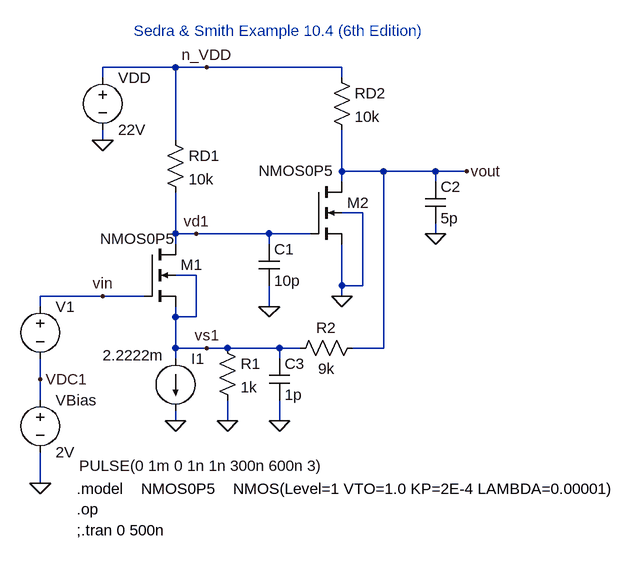
[diagram p0: schematic Sedra_Smith_Ex_10.4_2.asc]
Sedra_Smith_Ex_10.4_2.asc, the LTspice schematic file:
Version 4
SHEET 1 1708 680
WIRE 224 -80 112 -80
WIRE 272 -80 224 -80
WIRE 480 -80 272 -80
WIRE 112 -64 112 -80
WIRE 480 -64 480 -80
WIRE 112 32 112 16
WIRE 224 32 224 -80
WIRE 480 80 480 16
WIRE 544 80 480 80
WIRE 624 80 544 80
WIRE 672 80 624 80
WIRE 480 96 480 80
WIRE 624 96 624 80
WIRE 512 144 480 144
WIRE 224 176 224 112
WIRE 256 176 224 176
WIRE 368 176 256 176
WIRE 432 176 368 176
WIRE 624 176 624 160
WIRE 224 192 224 176
WIRE 368 192 368 176
WIRE 256 240 224 240
WIRE 480 256 480 192
WIRE 512 256 512 144
WIRE 512 256 480 256
WIRE 112 272 16 272
WIRE 176 272 112 272
WIRE 480 272 480 256
WIRE 16 288 16 272
WIRE 368 288 368 256
WIRE 224 304 224 288
WIRE 256 304 256 240
WIRE 256 304 224 304
WIRE 224 352 224 304
WIRE 272 352 224 352
WIRE 304 352 272 352
WIRE 384 352 304 352
WIRE 416 352 384 352
WIRE 544 352 544 80
WIRE 544 352 496 352
WIRE 224 368 224 352
WIRE 384 368 384 352
WIRE 16 400 16 368
WIRE 16 432 16 400
WIRE 224 464 224 448
WIRE 304 464 304 432
WIRE 384 464 384 432
WIRE 16 560 16 512
FLAG 304 464 0
FLAG 224 464 0
FLAG 112 32 0
FLAG 480 272 0
FLAG 672 80 vout
FLAG 256 176 vd1
FLAG 272 352 vs1
FLAG 112 272 vin
FLAG 16 560 0
FLAG 368 288 0
FLAG 624 176 0
FLAG 384 464 0
FLAG 272 -80 n_VDD
FLAG 16 400 VDC1
SYMBOL nmos4 432 96 R0
WINDOW 3 -80 -17 Left 2
SYMATTR Value NMOS0P5
SYMATTR InstName M2
SYMATTR Value2 l=10u w=200u
SYMBOL nmos4 176 192 R0
WINDOW 3 -68 -8 Left 2
SYMATTR Value NMOS0P5
SYMATTR InstName M1
SYMATTR Value2 l=10u w=200u
SYMBOL voltage 16 272 R0
WINDOW 3 60 261 Left 2
SYMATTR Value PULSE(0 1m 0 1n 1n 300n 600n 3)
SYMATTR InstName V1
SYMATTR Value2 AC 1
SYMBOL res 288 336 R0
SYMATTR InstName R1
SYMATTR Value 1k
SYMBOL res 512 336 R90
WINDOW 0 0 56 VBottom 2
WINDOW 3 32 56 VTop 2
SYMATTR InstName R2
SYMATTR Value 9k
SYMBOL res 208 16 R0
SYMATTR InstName RD1
SYMATTR Value 10k
SYMBOL res 464 -80 R0
SYMATTR InstName RD2
SYMATTR Value 10k
SYMBOL voltage 112 -80 R0
SYMATTR InstName VDD
SYMATTR Value 22V
SYMBOL current 224 368 R0
WINDOW 3 -112 -5 Left 2
SYMATTR Value 2.2222m
SYMATTR InstName I1
SYMBOL voltage 16 416 R0
SYMATTR InstName VBias
SYMATTR Value 2V
SYMBOL cap 352 192 R0
SYMATTR InstName C1
SYMATTR Value 10p
SYMBOL cap 608 96 R0
SYMATTR InstName C2
SYMATTR Value 5p
SYMBOL cap 368 368 R0
SYMATTR InstName C3
SYMATTR Value 1p
TEXT 160 -136 Left 2 ;Sedra & Smith Example 10.4 (6th Edition)
TEXT 72 568 Left 2 !.model	NMOS0P5	NMOS(Level=1 VTO=1.0 KP=2E-4 LAMBDA=0.00001)
TEXT 72 600 Left 2 !.op
TEXT 72 632 Left 2 !;.tran 0 500n

The netlist it stands for:
* Sedra_Smith_Ex_10.4_2.asc
M2 vout vd1 0 0 NMOS0P5 l=10u w=200u
M1 vd1 vin vs1 vs1 NMOS0P5 l=10u w=200u
V1 vin VDC1 PULSE(0 1m 0 1n 1n 300n 600n 3) AC 1
R1 vs1 0 1k
R2 vout vs1 9k
RD1 n_VDD vd1 10k
RD2 n_VDD vout 10k
VDD n_VDD 0 22V
I1 vs1 0 2.2222m
VBias VDC1 0 2V
C1 vd1 0 10p
C2 vout 0 5p
C3 vs1 0 1p
.model NMOS NMOS
.model PMOS PMOS
.lib standard.mos
* Sedra & Smith Example 10.4 (6th Edition)
.model	NMOS0P5	NMOS(Level=1 VTO=1.0 KP=2E-4 LAMBDA=0.00001)
.op
;.tran 0 500n
.backanno
.end